# EAGLE design prototype1-ftdi-as-breakout (EAGLE 9.3.0)

## Sheet 1 of 4
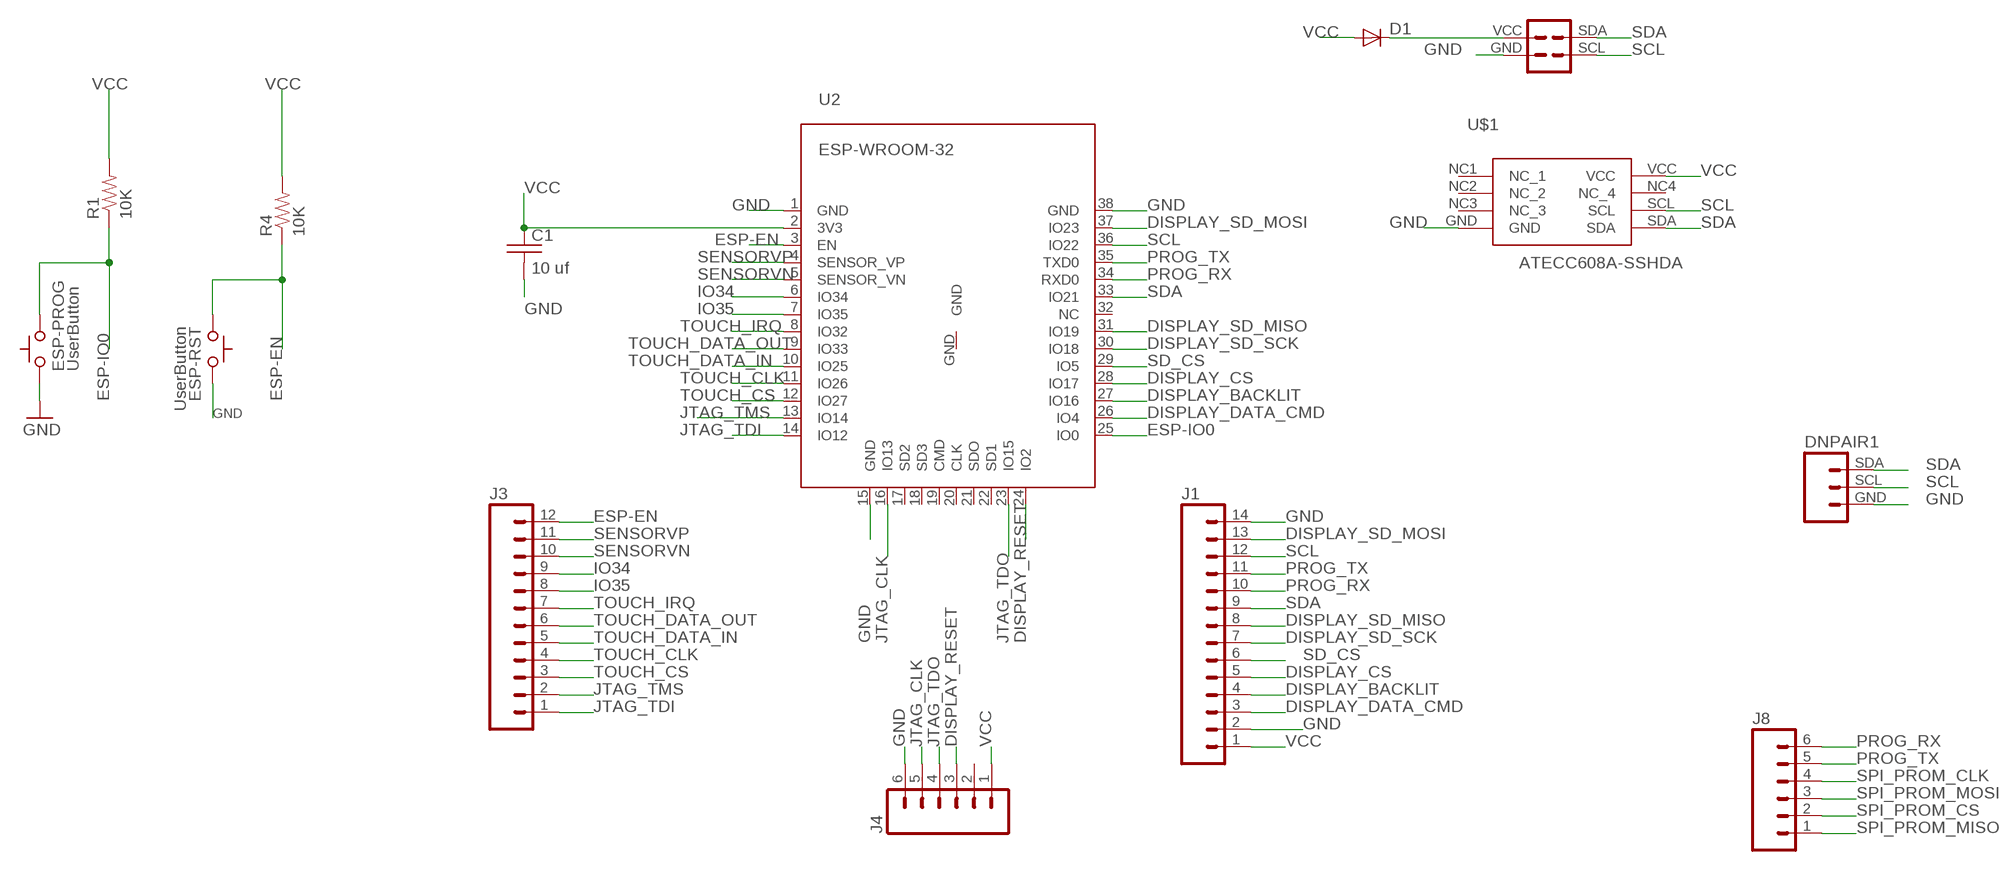
[diagram p0: schematic, sheet 1]

### Parts
C1  10 uf  C-USC0805  [C0805]
D1  DIODESMA  [SMA-DIODE]
DNPAIR1  DARKNET_8_PAIR_CONNECTORPTH  [1X03]
ESP-PROG  UserButton  SWITCH_TACTILETACTILE-2PIN-NARROW  [TACTILE-2PIN-NARROW]
ESP-RST  UserButton  SWITCH_TACTILETACTILE-2PIN-NARROW  [TACTILE-2PIN-NARROW]
J1  M14  [1X14]
J3  M12PTH  [1X12]
J4  M06SILK_FEMALE_PTH  [1X06]
J8  M06SILK_FEMALE_PTH  [1X06]
R1  10K  RESISTOR0805-RES  [0805]
R4  10K  RESISTOR0805-RES  [0805]
SHITTY_ADDON  SAO1  DC26_SHITTY_ADDON_CONNECTORPTH  [DC26SHITTY_ADDON_CONNECTOR]
U2  ESP-WROOM-32  [ESP-WROOM-32]
U$1  ATECC608A-SSHDA  [8-SOIC]

### Nets
DISPLAY_BACKLIT: J1.4 U2.27(IO16)
DISPLAY_CS: J1.5 U2.28(IO17)
DISPLAY_DATA_CMD: J1.3 U2.26(IO4)
DISPLAY_RESET: J4.3 U2.24(IO2)
DISPLAY_SD_MISO: J1.8 U2.31(IO19)
DISPLAY_SD_MOSI: J1.13 U2.37(IO23)
DISPLAY_SD_SCK: J1.7 U2.30(IO18)
ESP-EN: ESP-RST.P$2(C) J3.12 R4.1 U2.3(EN)
ESP-IO0: ESP-PROG.P$1(A) R1.1 U2.25(IO0)
GND: C1.2 DNPAIR1.GND ESP-PROG.P$2(C) ESP-RST.P$1(A) J1.2 J1.14 J4.6 SHITTY_ADDON.GND U2.1(GND) U2.15(GND) U2.38(GND) U$1.GND ; also sheet 2,3
IO34: J3.9 U2.6(IO34)
IO35: J3.8 U2.7(IO35)
JTAG_CLK: J4.5 U2.16(IO13)
JTAG_TDI: J3.1 U2.14(IO12)
JTAG_TDO: J4.4 U2.23(IO15)
JTAG_TMS: J3.2 U2.13(IO14)
N$14: D1.C SHITTY_ADDON.VCC
PROG_RX: J1.10 J8.6 U2.34(RXD0)
PROG_TX: J1.11 J8.5 U2.35(TXD0)
SCL: DNPAIR1.SCL J1.12 SHITTY_ADDON.SCL U2.36(IO22) U$1.SCL
SD_CS: J1.6 U2.29(IO5)
SDA: DNPAIR1.SDA J1.9 SHITTY_ADDON.SDA U2.33(IO21) U$1.SDA
SENSORVN: J3.10 U2.5(SENSOR_VN)
SENSORVP: J3.11 U2.4(SENSOR_VP)
SPI_PROM_CLK: J8.4 ; also sheet 2
SPI_PROM_CS: J8.2 ; also sheet 2
SPI_PROM_MISO: J8.1 ; also sheet 2
SPI_PROM_MOSI: J8.3 ; also sheet 2
TOUCH_CLK: J3.4 U2.11(IO26)
TOUCH_CS: J3.3 U2.12(IO27)
TOUCH_DATA_IN: J3.5 U2.10(IO25)
TOUCH_DATA_OUT: J3.6 U2.9(IO33)
TOUCH_IRQ: J3.7 U2.8(IO32)
VCC: C1.1 D1.A J1.1 J4.1 R1.2 R4.2 U2.2(3V3) U$1.VCC ; also sheet 2,3
Unconnected: J4.2 U2.17(SD2) U2.18(SD3) U2.19(CMD) U2.20(CLK) U2.21(SDO) U2.22(SD1) U2.32(NC) U2.GND U$1.NC1(NC_1) U$1.NC2(NC_2) U$1.NC3(NC_3) U$1.NC4(NC_4)

## Sheet 2 of 4
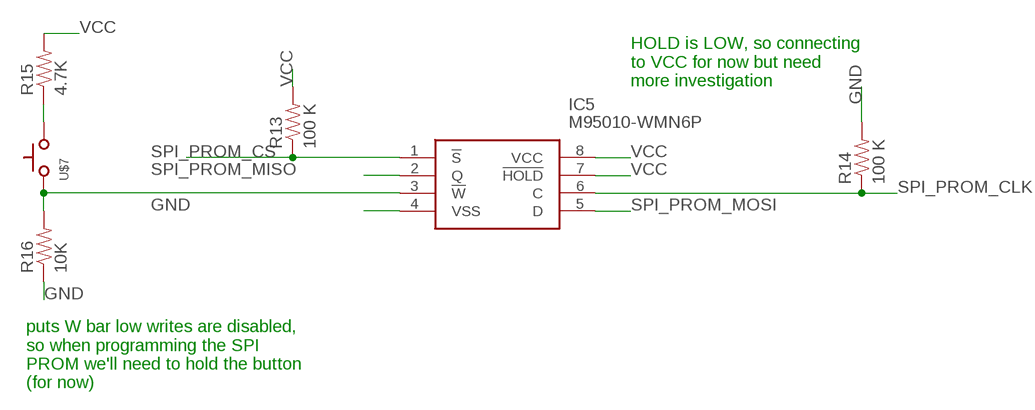
[diagram p1: schematic, sheet 2]

### Parts
IC5  M95010-WMN6P  [SOIC127P600X175-8N]
R13  100 K  RESISTOR0805-RES  [0805]
R14  100 K  RESISTOR0805-RES  [0805]
R15  4.7K  RESISTOR0805-RES  [0805]
R16  10K  RESISTOR0805-RES  [0805]
U$7  SWITCH_TACTILETACTILE-2PIN-NARROW  [TACTILE-2PIN-NARROW]

### Nets
GND: IC5.4(VSS) R14.2 R16.1 ; also sheet 1,3
N$3: IC5.3(!W) R16.2 U$7.P$2(C)
N$9: R15.1 U$7.P$1(A)
SPI_PROM_CLK: IC5.6(C) R14.1 ; also sheet 1
SPI_PROM_CS: IC5.1(!S) R13.1 ; also sheet 1
SPI_PROM_MISO: IC5.2(Q) ; also sheet 1
SPI_PROM_MOSI: IC5.5(D) ; also sheet 1
VCC: IC5.7(!HOLD) IC5.8(VCC) R13.2 R15.2 ; also sheet 1,3

### Notes on the sheet
- HOLD is LOW, so connecting 
  to VCC for now but need 
  more investigation
- puts W bar low writes are disabled, 
  so when programming the SPI 
  PROM we'll need to hold the button 
  (for now)

## Sheet 3 of 4
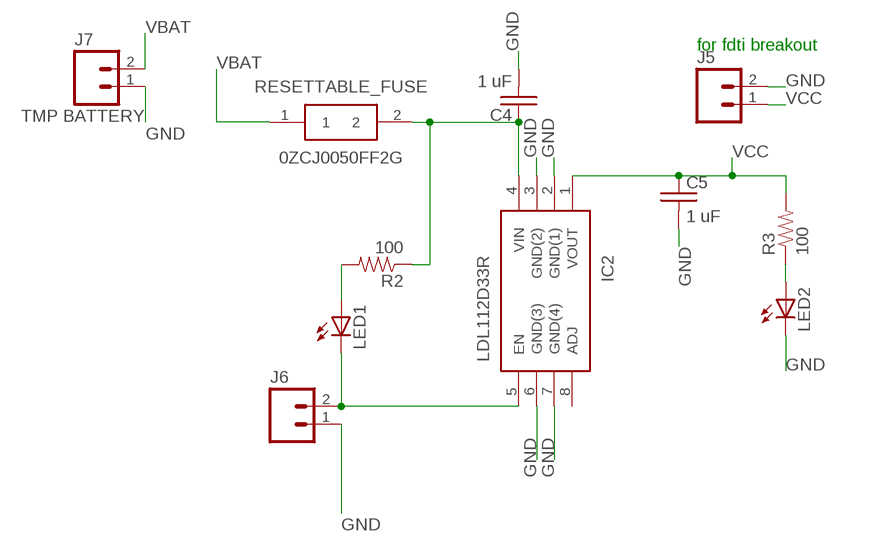
[diagram p2: schematic, sheet 3]

### Parts
C4  1 uF  C-USC0805  [C0805]
C5  1 uF  C-USC0805  [C0805]
IC2  LDL112D33R  [SOIC127P600X175-8N]
J5  M02PTH  [1X02]
J6  M02PTH  [1X02]
J7  TMP BATTERY  M02PTH  [1X02]
LED1  LED3MM  [LED3MM]
LED2  LED3MM  [LED3MM]
R2  100  RESISTOR0805-RES  [0805]
R3  100  RESISTOR0805-RES  [0805]
RESETTABLE_FUSE  0ZCJ0050FF2G  [FUSC3216X55N]

### Nets
GND: C4.2 C5.2 IC2.2(GND(1)) IC2.3(GND(2)) IC2.6(GND(3)) IC2.7(GND(4)) J5.2 J6.1 J7.1 LED2.K(C) ; also sheet 1,2
N$1: C4.1 IC2.4(VIN) R2.1 RESETTABLE_FUSE.2
N$2: LED1.A R2.2
N$5: LED2.A R3.1
N$12: IC2.5(EN) J6.2 LED1.K(C)
VBAT: J7.2 RESETTABLE_FUSE.1
VCC: C5.1 IC2.1(VOUT) J5.1 R3.2 ; also sheet 1,2
Unconnected: IC2.8(ADJ)

### Notes on the sheet
- for fdti breakout

## Sheet 4 of 4
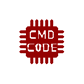
[diagram p3: schematic, sheet 4]

### Parts
U$2  CMD_C0DE_LOGOCMD_CODE_LOGO_TOP_COPPER  [CMD_C0DE_LOGO_TOP_COPPER]

## Library data of the parts
C1 C4 C5 = passives:C-US: CAPACITOR, American symbol
D1 = passives:DIODE: Diode These are standard reverse protection diodes and small signal diodes. SMA package can handle up to about 1A. SOD-323 can handle about 200mA. What the SOD-323 package when ordering, there are some mfgs out there that are 5-pin packages.
DNPAIR1 = darknet8:DARKNET_8_PAIR_CONNECTOR: Header 3 Standard 3-pin 0.1" header. Use with straight break away headers (SKU : PRT-00116), right angle break away headers (PRT-00553), swiss pins (PRT-00743), machine pins (PRT-00117), and female headers (PRT-00115).
ESP-PROG ESP-RST = dc-26:SWITCH_TACTILE
IC2 = voltage-regulator:LDL112D33R: LDO Voltage Regulators 1.2 A low quiescent current LDO with reverse current protection Source: Datasheet <https://www.arrow.com/en/products/ldl112d33r/stmicroelectronics>; ARROW_PART_NUMBER: LDL112D33R; ARROW_PRICE/STOCK: https://www.arrow.com/en/products/ldl112d33r/stmicroelectronics; DESCRIPTION: LDO Voltage Regulators 1.2 A low quiescent current LDO with reverse current protection; HEIGHT: 1.75mm; MANUFACTURER_NAME: STMicroelectronics; MANUFACTURER_PART_NUMBER: LDL112D33R
IC5 = eeprom:M95010-WMN6P: M95010-WMN6P, Serial EEPROM Memory 1kbit, Serial-SPI, 35ns 2.5 5.5 V, 8-Pin SOIC Source: Datasheet <http://www.st.com/st-web-ui/static/active/en/resource/technical/document/datasheet/CD00001755.pdf>; ALLIED_NUMBER: 70389563; ALLIED_PRICE-STOCK: http://www.alliedelec.com/stmicroelectronics-m95010-wmn6p/70389563/; DESCRIPTION: M95010-WMN6P, Serial EEPROM Memory 1kbit, Serial-SPI, 35ns 2.5 5.5 V, 8-Pin SOIC; HEIGHT: 1.75mm; MANUFACTURER_NAME: STMicroelectronics; MANUFACTURER_PART_NUMBER: M95010-WMN6P; MOUSER_PART_NUMBER: 511-M95010-WMN6P; MOUSER_PRICE-STOCK: https://www.mouser.com/Search/Refine.aspx?Keyword=511-M95010-WMN6P; RS_PART_NUMBER: 7147617; RS_PRICE-STOCK: http://uk.rs-online.com/web/p/eeprom-memory-chips/7147617/?source=DS
J1 = connector:M14: Header 14 Standard 14-pin 0.1" header. Use with straight break away headers (SKU : PRT-00116), right angle break away headers (PRT-00553), swiss pins (PRT-00743), machine pins (PRT-00117), and female headers (PRT-00115).
J3 = connector:M12: Header 12 Standard 12-pin 0.1" header. Use with straight break away headers (SKU : PRT-00116), right angle break away headers (PRT-00553), swiss pins (PRT-00743), machine pins (PRT-00117), and female headers (PRT-00115).
J4 J8 = connector:M06: Header 6 Standard 6-pin 0.1" header. Use with straight break away headers (SKU : PRT-00116), right angle break away headers (PRT-00553), swiss pins (PRT-00743), machine pins (PRT-00117), and female headers (PRT-00115). Molex polarized connector foot print use with SKU : PRT-08094 with associated crimp pins and housings. NOTES ON THE VARIANTS LOCK and LOCK_LONGPADS... This footprint was designed to help hold the alignment of a through-hole component (i.e. 6-pin header) while soldering it into place. You may notice that each hole has been shifted either up or down by 0.005 of an inch from it's more standard position (which is a perfectly straight line). This slight alteration caused the pins (the squares in the middle) to touch the edges of the holes. Because they are alternating, it causes a "brace" to hold the component in place. 0.005 has proven to be the perfect amount of "off-center" position when using our standard breakaway headers. Although looks a little odd when you look at the bare footprint, once you have a header in there, the alteration is very hard to notice. Also,if you push a header all the way into place, it is covered up entirely on the bottom side. This idea of altering the position of holes to aid alignment will be further integrated into the Sparkfun Library for other footprints. It can help hold any component with 3 or more connection pins.; PROD_ID: CONN-08437
J5-J7 = connector:M02: Standard 2-pin 0.1" header. Use with - straight break away headers ( PRT-00116) - right angle break away headers (PRT-00553) - swiss pins (PRT-00743) - machine pins (PRT-00117) - female headers (PRT-00115) Molex polarized connector foot print use with: PRT-08233 with associated crimp pins and housings. 2.54_SCREWTERM for use with PRT-10571. 3.5mm Screw Terminal footprints for PRT-08084 5mm Screw Terminal footprints for use with PRT-08432
LED1 LED2 = leds:LED: LEDs Standard schematic elements and footprints for 5mm, 3mm, 1206, and 0603 sized LEDs. 5mm - Spark Fun Electronics SKU : COM-00529 (and others)
R1 R4 = dc-26:RESISTOR: Resistor Basic schematic elements and footprints for 0603, 1206, and PTH resistors.
R2 R3 R13-R16 = passives:RESISTOR: Resistor Basic schematic elements and footprints for 0603, 1206, and PTH resistors.
RESETTABLE_FUSE = passives:0ZCJ0050FF2G: Resettable Fuses - PPTC <https://componentsearchengine.com/Images/9/0ZCJ0050FF2G.jpg> Source: Datasheet <https://www.belfuse.com/resources/CircuitProtection/datasheets/0ZCJ Nov2016.pdf>; DESCRIPTION: Resettable Fuses - PPTC; HEIGHT: 0.55mm; MANUFACTURER_NAME: Bel-Stewart; MANUFACTURER_PART_NUMBER: 0ZCJ0050FF2G; SUPPLIER_NAME: RS
SHITTY_ADDON = defcon:DC26_SHITTY_ADDON_CONNECTOR: Standard 2-pin 0.1" header. Use with - straight break away headers ( PRT-00116) - right angle break away headers (PRT-00553) - swiss pins (PRT-00743) - machine pins (PRT-00117) - female headers (PRT-00115) Molex polarized connector foot print use with: PRT-08233 with associated crimp pins and housings. 2.54_SCREWTERM for use with PRT-10571. 3.5mm Screw Terminal footprints for PRT-08084 5mm Screw Terminal footprints for use with PRT-08432
U2 = ICs:ESP-WROOM-32
U$1 = ICs:ATECC608A-SSHDA
U$2 = logos:CMD_C0DE_LOGO
U$7 = switches:SWITCH_TACTILE

## Board
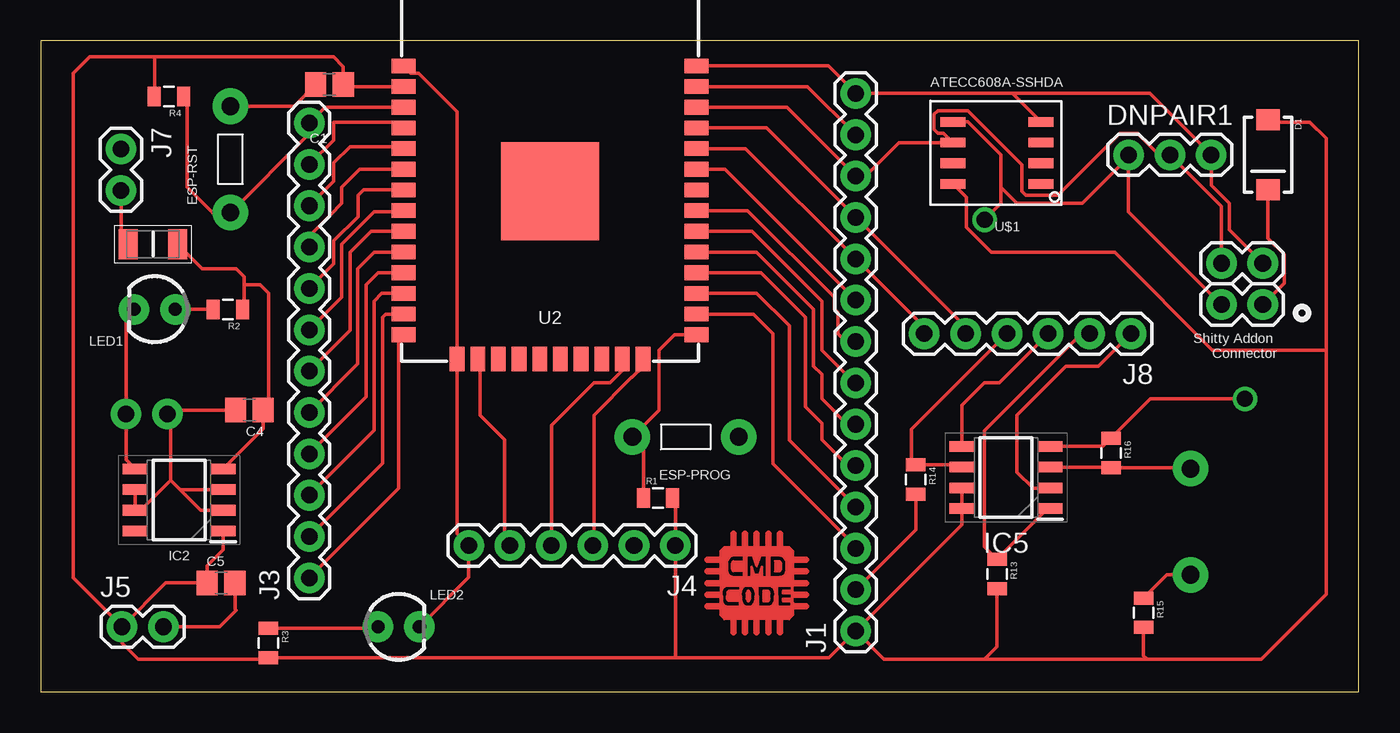
[diagram p4: board, top side]
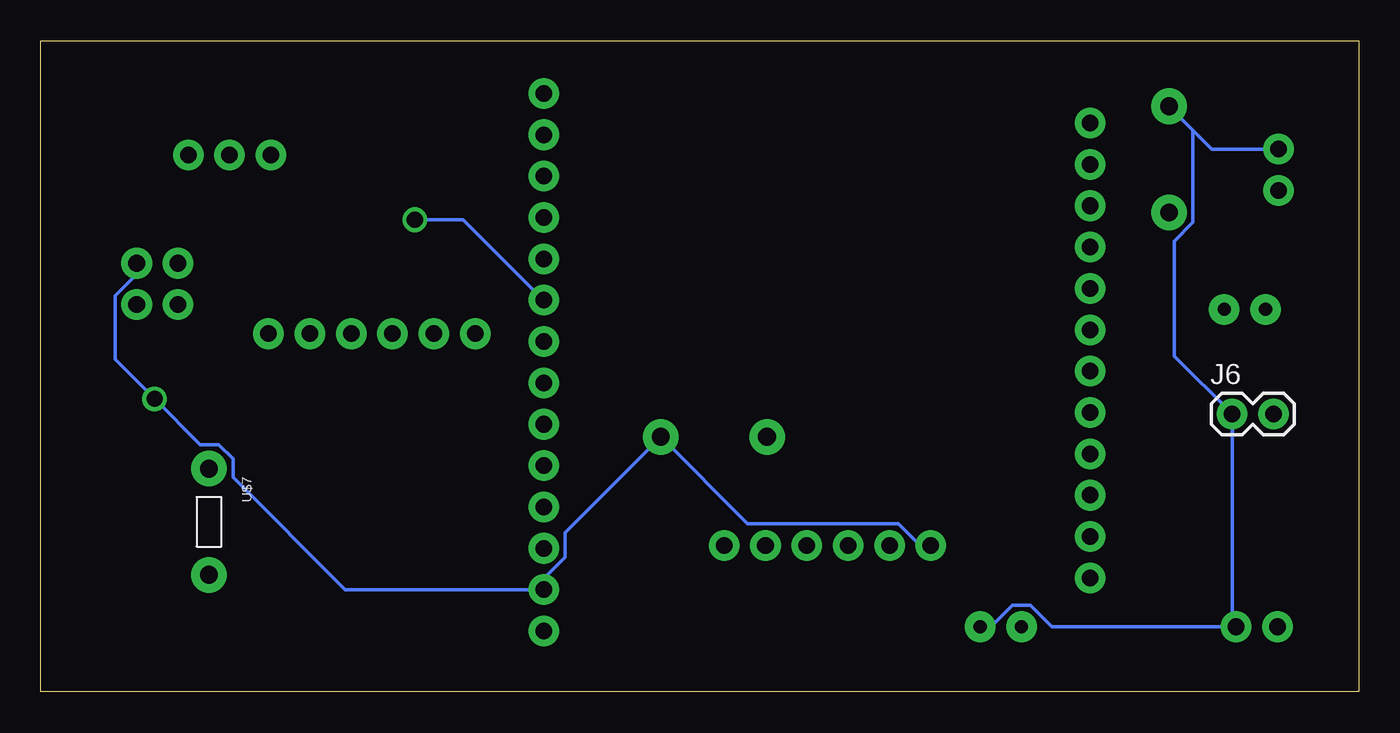
[diagram p5: board, bottom side, seen from below]

Size 81 x 40 mm. Coordinates in mm from the lower left corner, seen from the top.
Outline: 0,0 81,0 81,40 0,40 0,0
Copper layers (1*16): Top 0.035mm / dielectric 1.5mm / Bottom 0.035mm
Design rules "OthermillDRC_1_100_v2-cmd0de": minimum track width 8mil, minimum drill 0.8mm, track to track 0.2797mm, track to pad 0.2797mm, pad to pad 0.256540625mm, via to via 0.256540625mm, smd to smd 0mil, copper to edge 0mil, drill to drill 1mil, minimum pad ring 10mil, minimum via ring 10mil, stop-mask expansion 1mil, vias tented up to drill 30mil, thermal gap 10mil

### Footprints (pad centres in the part's own frame; a part is rotated, then mirrored left to right if it is on the bottom)
C0805 = smd 1.3 x 1.5: 1 -0.85,0; 2 0.85,0
SMA-DIODE = smd 1.27 x 1.47: A -2.15,0; C 2.15,0
1X03 = drill 1.016 pad 1.88: GND 5.08,0; SCL 2.54,0; SDA 0,0
TACTILE-2PIN-NARROW = drill 1.1 pad 2.184: P$1 3.264,0; P$2 -3.264,0
SOIC127P600X175-8N = smd 1.525 x 0.65: 1 -2.712,1.905; 2 -2.712,0.635; 3 -2.712,-0.635; 4 -2.712,-1.905; 5 2.712,-1.905; 6 2.712,-0.635; 7 2.712,0.635; 8 2.712,1.905
1X14 = drill 1.016 pad 1.88: 1 0,0; 2 2.54,0; 3 5.08,0; 4 7.62,0; 5 10.16,0; 6 12.7,0; 7 15.24,0; 8 17.78,0; 9 20.32,0; 10 22.86,0; 11 25.4,0; 12 27.94,0; 13 30.48,0; 14 33.02,0
1X12 = drill 1.016 pad 1.88: 1 0,0; 2 2.54,0; 3 5.08,0; 4 7.62,0; 5 10.16,0; 6 12.7,0; 7 15.24,0; 8 17.78,0; 9 20.32,0; 10 22.86,0; 11 25.4,0; 12 27.94,0
1X06 = drill 1.016 pad 1.88: 1 0,0; 2 2.54,0; 3 5.08,0; 4 7.62,0; 5 10.16,0; 6 12.7,0
1X02 = drill 1.016 pad 1.88: 1 0,0; 2 2.54,0
LED3MM = drill 0.813 pad 1.88: A -1.27,0; K 1.27,0
0805 = smd 0.8 x 1.2: 1 -0.9,0; 2 0.9,0
FUSC3216X55N = smd 1.17 x 1.82: 1 -1.52,0; 2 1.52,0
DC26SHITTY_ADDON_CONNECTOR = drill 1.016 pad 1.88: GND 0,-2.54; SCL 2.54,-2.54; SDA 2.54,0; VCC 0,0
ESP-WROOM-32 = smd 0.9 x 1.5: 1 7.7,9; 2 6.43,9; 3 5.16,9; 4 3.89,9; 5 2.62,9; 6 1.35,9; 7 0.08,9; 8 -1.19,9; 9 -2.46,9; 10 -3.73,9; 11 -5,9; 12 -6.27,9; 13 -7.54,9; 14 -8.81,9; 25 -8.81,-9; 26 -7.54,-9; 27 -6.27,-9; 28 -5,-9; 29 -3.73,-9; 30 -2.46,-9; 31 -1.19,-9; 32 0.08,-9; 33 1.35,-9; 34 2.62,-9; 35 3.89,-9; 36 5.16,-9; 37 6.43,-9; 38 7.7,-9 | smd 1.5 x 0.9: 15 -10.3,5.715; 16 -10.3,4.445; 17 -10.3,3.175; 18 -10.3,1.905; 19 -10.3,0.635; 20 -10.3,-0.635; 21 -10.3,-1.905; 22 -10.3,-3.175; 23 -10.3,-4.445; 24 -10.3,-5.715 | smd 6 x 6: GND 0,0
8-SOIC = smd 0.6 x 1.55: GND 3.81,0; NC1 0,0; NC2 1.27,0; NC3 2.54,0; NC4 1.27,5.4; SCL 2.54,5.4; SDA 3.81,5.4; VCC 0,5.4

### Placement (x,y rotation side)
C1  17.75,37.31 180 top
C4  12.83,17.31 180 top
C5  11.09,6.69 0 top
D1  75.42,32.99 270 top
DNPAIR1  66.85,32.99 0 top
ESP-PROG  39.63,15.66 180 top
ESP-RST  11.66,32.71 90 top
IC2  8.51,11.79 180 top
IC5  59.32,13.17 180 top
J1  50.09,3.74 90 top
J3  16.5,7 90 top
J4  39,9 180 top
J5  5,4 0 top
J6  7.78,17.07 0 bottom
J7  4.94,33.34 270 top
J8  67,22 180 top
LED1  7,23.5 180 top
LED2  22,4 0 top
R1  37.93,11.92 0 top
R2  11.5,23.5 180 top
R3  14,3 270 top
R4  7.88,36.58 180 top
R13  58.77,7.24 270 top
R14  53.77,13.05 270 top
R15  67.77,4.86 270 top
R16  65.77,14.67 270 top
RESETTABLE_FUSE  6.9,27.5 0 top
SHITTY_ADDON  75.1,23.79 180 top
U2  31.3,30.75 90 top
U$1  61.46,31.2 90 top
U$2  44,7 0 top
U$7  70.66,10.45 270 bottom

### Tracks (layer width: path | path; a pad name or v marks a point on that pad's centre or on a via)
DISPLAY_BACKLIT
  Top 0.203: U2.27 43.98,24.48 44,24.5 46,22.5 46,15.45 J1.4
DISPLAY_CS
  Top 0.203: U2.28 44.25,25.75 47,23 47,17.5 48,16.5 48,15.5 49.6,13.9 J1.5
DISPLAY_DATA_CMD
  Top 0.203: U2.26 43.79,23.21 45,22 45,14 50.09,8.91 J1.3
DISPLAY_RESET
  Top 0.203: J4.3 34,9.08 34,17 36.32,19.32 36.35,19.32 37.02,19.98 U2.24
DISPLAY_SD_MISO
  Top 0.203: U2.31 43.44,29.56 48.77,24.23 48.77,23.51 49,23.28 49,22 49.48,21.52 J1.8
DISPLAY_SD_MOSI
  Top 0.203: U2.37 47.13,37.18 J1.13
DISPLAY_SD_SCK
  Top 0.203: U2.30 43.71,28.29 48,24 48,21 50.02,18.98 J1.7
ESP-EN
  Top 0.203: U2.3 17.47,35.91 J3.12 16.44,35 16.44,34.23 ESP-RST.P$2 10.55,29.45 9,31 9,36.36 R4.1
ESP-IO0
  Top 0.203: U2.25 38.94,21.94 38,21 38,17.29 ESP-PROG.P$1 37.03,15 R1.1
GND  (via drill 1)
  Top 0.203: 8,13 8,16.85 J6.1 8.02,17.31 C4.2 | 8,13 6.16,11.15 IC2.7 IC2.6 | 8.57,12.43 9.85,11.15 IC2.2 | IC2.3 8.57,12.43 | 8.57,12.43 8,13 | C5.2 11.94,5.06 12,5 11,4 J5.2 | LED2.K 26.3,7.03 J4.6 25.59,9.71 U2.15 25.59,35.63 23.21,38.01 22.74,38.01 U2.1 | U2.38 48.4,38.45 J1.14 59.71,36.76 | 59.71,36.76 U$1.GND | 59.71,36.76 68.16,36.76 DNPAIR1.GND 71.93,31.13 73.04,30.02 73.04,28.39 SHITTY_ADDON.GND | J1.2 53.77,9.96 R14.2 | IC5.4 65.28,15.07 R16.1 68.2,18 v74,18 | C1.2 15.56,35.97 ESP-RST.P$1
  Bottom 0.203: SHITTY_ADDON.GND 75.1,25.66 76.42,24.34 76.42,20.42 v74,18 71.19,15.19 70.05,15.19 69.19,14.32 69.19,13.19 62.28,6.28 J1.2 50.09,6.95 48.77,8.27 48.77,9.79 ESP-PROG.P$2 37.55,10.32 28.29,10.32 26.97,9 J4.6 | LED2.K 22.6,4 21.28,5.32 20.18,5.32 18.86,4 J5.2 7.78,4.24 J6.1 11.34,20.63 11.34,27.68 10.19,28.84 10.19,34.5 ESP-RST.P$1 9.03,33.34 J7.1
IO34
  Top 0.203: U2.6 19.6,32.1 18.5,31 18.5,30 17.82,29.32 17.82,29.31 17.05,28.54 17.04,28.54 16.5,28 J3.9
IO35
  Top 0.203: U2.7 19.83,30.83 19.5,30.5 19.5,29.18 18.02,27.7 18.02,26.3 J3.8
JTAG_CLK
  Top 0.203: U2.16 27,20.3 27,17 28.5,15.5 28.5,9.34 J4.5
JTAG_TDI
  Top 0.203: J3.1 22,12.5 22,21.64 U2.14
JTAG_TDO
  Top 0.203: J4.4 31.38,16.38 34,19 35,19 35.74,19.75 U2.23
JTAG_TMS
  Top 0.203: J3.2 21,14.04 21,23 21.21,23.21 U2.13
N$1
  Top 0.203: RESETTABLE_FUSE.2 9.92,26 12,26 12.5,25.5 12.5,25 | 12.5,25 12.5,23.6 R2.1 | 12.5,25 13.5,25 14,24.5 14,17.63 C4.1 13.68,16.15 IC2.4
N$2
  Top 0.203: R2.2 LED1.A
N$3
  Top 0.203: U$7.P$2 70.6,13.77 R16.2 65.73,13.8 IC5.3
N$5
  Top 0.203: R3.1 20.63,3.9 LED2.A
N$9
  Top 0.203: R15.1 69.2,7.19 U$7.P$1
N$12
  Top 0.203: LED1.K 5.24,23.01 J6.2 5.24,14.25 IC2.5
N$14
  Top 0.203: SHITTY_ADDON.VCC 76.42,25.11 76.42,26.88 75.42,27.88 D1.C
PROG_RX
  Top 0.203: U2.34 43.32,33.37 J1.10 54.3,22.39 J8.6
PROG_TX
  Top 0.203: U2.35 44.59,34.64 J1.11 56.84,22.39 J8.5
SCL
  Top 0.203: U2.36 45.86,35.91 J1.12 50.68,31.68 52.74,33.74 U$1.SCL 55.47,34.33 55.13,34.33 54.9,34.55 54.9,35.47 55.13,35.69 56.99,35.69 60.3,32.38 60.3,30.74 60.53,30.52 62.51,30.52 66.3,34.31 67.4,34.31 68.72,32.99 DNPAIR1.SCL 72.56,29.82 SHITTY_ADDON.SCL
SD_CS
  Top 0.203: U2.29 40.32,27 44,27 47.5,23.5 47.5,20 48,19.5 48,18 49.56,16.44 J1.6
SDA  (via drill 1)
  Top 0.203: U2.33 42.05,32.1 J1.9 | U$1.SDA 56.99,35.01 59,33 59,31 | 59,31 60,30 64,30 66.85,32.85 | 66.85,32.85 DNPAIR1.SDA | SHITTY_ADDON.SDA 66.85,29.5 66.85,32.85 | v58,29 59,30 59,31
  Bottom 0.203: J1.9 55.03,29 v58,29
SENSORVN
  Top 0.203: U2.5 22.17,33.5 19,33.5 18,32.5 18,31.36 J3.10
SENSORVP
  Top 0.203: U2.4 21.94,35 18,35 18,33.9 J3.11
SPI_PROM_CLK
  Top 0.203: J8.4 53.5,16.12 53.5,14.22 R14.1 56.46,13.95 IC5.6
SPI_PROM_CS
  Top 0.203: J8.2 63.96,22 58,16.04 58,8.91 R13.1 61.9,11.27 IC5.1
SPI_PROM_MISO
  Top 0.203: J8.1 65,20 63,20 60,17 60,13.5 61,12.5 62,12.5 IC5.2
SPI_PROM_MOSI
  Top 0.203: J8.3 58.92,19 58,19 56.61,17.61 IC5.5
TOUCH_CLK
  Top 0.203: J3.4 20,18.12 20,25 20.75,25.75 U2.11
TOUCH_CS
  Top 0.203: J3.3 20.48,16.06 20.48,24 20.96,24.48 U2.12
TOUCH_DATA_IN
  Top 0.203: U2.10 22.28,27 20.48,27 19.48,26 19.48,20.14 J3.5
TOUCH_DATA_OUT
  Top 0.203: J3.6 19,22.2 19,27 20.29,28.29 U2.9
TOUCH_IRQ
  Top 0.203: U2.8 22.24,29.5 20.5,29.5 18.5,27.5 18.5,24.24 J3.7
VBAT
  Top 0.203: J7.2 4.94,28.06 5.38,27.62 RESETTABLE_FUSE.1
VCC
  Top 0.203: IC2.1 11.22,8.72 10.24,7.74 C5.1 7.69,6.69 J5.1 | J5.1 5,3 6,2 13.9,2 R3.2 39,2.1 | J5.1 2,7 2,38 3,39 7,39 | R4.2 7,36.6 7,39 | R1.2 39,11.75 J4.1 39,2.1 | 39,2.1 48.45,2.1 J1.1 | J1.1 51.83,2 58,2 | 58,2 68,2 | 68,2 75,2 79,6 79,21 | 79,21 79,34 78,35 75.56,35 D1.A | U$1.VCC 56.89,30.37 56.89,28.54 58.43,27 66,27 72,21 79,21 | IC5.7 IC5.8 56.61,10.26 J1.1 | R13.2 58.77,2.77 58,2 | R15.2 67.77,2.23 68,2 | 7,39 18,39 18.6,38.4 C1.1 18.73,37.18 U2.2